# Altium schematic sheet PDC.SchDoc
size E
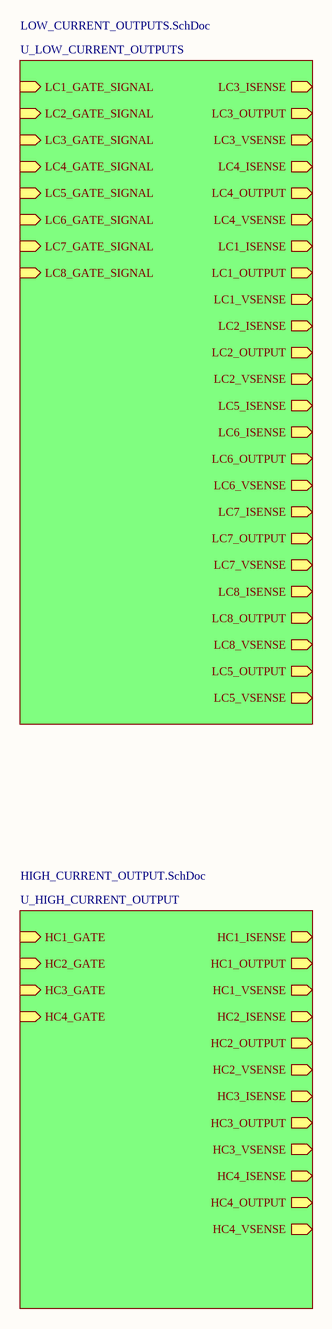
[diagram p0: PDC.SchDoc]

## Sub-sheets
U_HIGH_CURRENT_OUTPUT = HIGH_CURRENT_OUTPUT.SchDoc: HC1_ISENSE (out), HC1_OUTPUT (out), HC1_VSENSE (out), HC1_GATE (in), HC2_ISENSE (out), HC2_OUTPUT (out), HC2_VSENSE (out), HC2_GATE (in), HC3_ISENSE (out), HC3_OUTPUT (out), HC3_VSENSE (out), HC3_GATE (in), HC4_ISENSE (out), HC4_OUTPUT (out), HC4_VSENSE (out), HC4_GATE (in)
U_LOW_CURRENT_OUTPUTS = LOW_CURRENT_OUTPUTS.SchDoc: LC1_GATE_SIGNAL (in), LC2_GATE_SIGNAL (in), LC3_GATE_SIGNAL (in), LC4_GATE_SIGNAL (in), LC5_GATE_SIGNAL (in), LC6_GATE_SIGNAL (in), LC7_GATE_SIGNAL (in), LC8_GATE_SIGNAL (in), LC3_ISENSE (out), LC3_OUTPUT (out), LC3_VSENSE (out), LC4_ISENSE (out), LC4_OUTPUT (out), LC4_VSENSE (out), LC1_ISENSE (out), LC1_OUTPUT (out), LC1_VSENSE (out), LC2_ISENSE (out), LC2_OUTPUT (out), LC2_VSENSE (out), LC5_ISENSE (out), LC6_ISENSE (out), LC6_OUTPUT (out), LC6_VSENSE (out), LC7_ISENSE (out), LC7_OUTPUT (out), LC7_VSENSE (out), LC8_ISENSE (out), LC8_OUTPUT (out), LC8_VSENSE (out), LC5_OUTPUT (out), LC5_VSENSE (out)